# EAGLE design untitled (EAGLE 9.3.2)
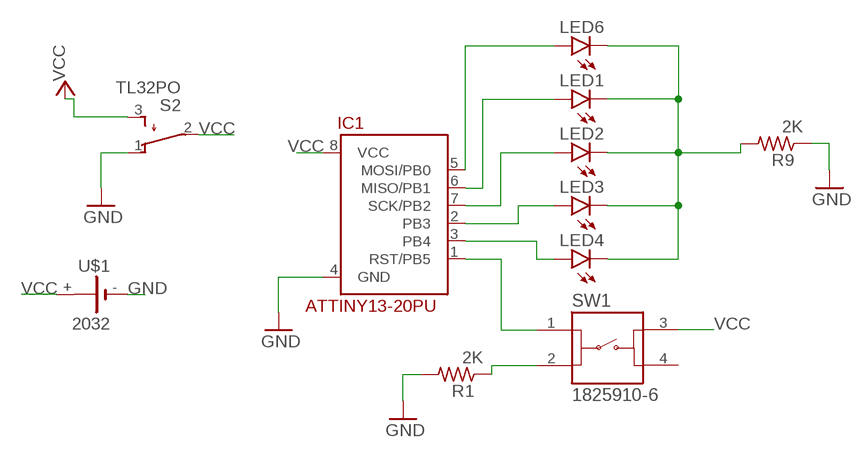
[diagram p0: schematic, sheet 1]

## Parts
IC1  ATTINY13-20PU  [DIL08]
LED1  LED3MM  [LED3MM]
LED2  LED3MM  [LED3MM]
LED3  LED3MM  [LED3MM]
LED4  LED3MM  [LED3MM]
LED6  LED3MM  [LED3MM]
R1  2K  R-US_0204/7  [0204/7]
R9  2K  R-US_0204/7  [0204/7]
S2  TL32PO  [TL3XPO]
SW1  1825910-6  [1825910-6]
U$1  2032  [KZH20SMD]

## Nets
GND: IC1.4(GND) R1.2 R9.1 S2.1(O) U$1.-
N$1: IC1.5(MOSI/PB0) LED6.A
N$2: IC1.6(MISO/PB1) LED1.A
N$3: IC1.7(SCK/PB2) LED2.A
N$4: IC1.2(PB3) LED3.A
N$5: IC1.3(PB4) LED4.A
N$6: LED1.K(C) LED2.K(C) LED3.K(C) LED4.K(C) LED6.K(C) R9.2
N$7: IC1.1(RST/PB5) SW1.1
N$8: R1.1 SW1.2
VCC: IC1.8(VCC) S2.2(P) S2.3(S) SW1.3 U$1.+
Unconnected: SW1.4

## Library data of the parts
IC1 = attiny13:ATTINY13-20*
LED1-LED4 LED6 = led:LED: LED OSRAM: - CHIPLED LG R971, LG N971, LY N971, LG Q971, LY Q971, LO R971, LY R971 LH N974, LH R974 LS Q976, LO Q976, LY Q976 LO Q996 - Hyper CHIPLED LW Q18S LB Q993, LB Q99A, LB R99A - SideLED LS A670, LO A670, LY A670, LG A670, LP A670 LB A673, LV A673, LT A673, LW A673 LH A674 LY A675 LS A676, LA A676, LO A676, LY A676, LW A676 LS A679, LY A679, LG A679 - Hyper Micro SIDELED® LS Y876, LA Y876, LO Y876, LY Y876 LT Y87S - SmartLED LW L88C, LW L88S LB L89C, LB L89S, LG L890 LS L89K, LO L89K, LY L89K LS L896, LA L896, LO L896, LY L896 - TOPLED LS T670, LO T670, LY T670, LG T670, LP T670 LSG T670, LSP T670, LSY T670, LOP T670, LYG T670 LG T671, LOG T671, LSG T671 LB T673, LV T673, LT T673, LW T673 LH T674 LS T676, LA T676, LO T676, LY T676, LB T676, LH T676, LSB T676, LW T676 LB T67C, LV T67C, LT T67C, LS T67K, LO T67K, LY T67K, LW E67C LS E67B, LA E67B, LO E67B, LY E67B, LB E67C, LV E67C, LT E67C LW T67C LS T679, LY T679, LG T679 LS T770, LO T770, LY T770, LG T770, LP T770 LB T773, LV T773, LT T773, LW T773 LH T774 LS E675, LA E675, LY E675, LS T675 LS T776, LA T776, LO T776, LY T776, LB T776 LHGB T686 LT T68C, LB T68C - Hyper Mini TOPLED® LB M676 - Mini TOPLED Santana® LG M470 LS M47K, LO M47K, LY M47K Source: http://www.osram.convergy.de LUXEON: - LUMILED® LXK2-PW12-R00, LXK2-PW12-S00, LXK2-PW14-U00, LXK2-PW14-V00 LXK2-PM12-R00, LXK2-PM12-S00, LXK2-PM14-U00 LXK2-PE12-Q00, LXK2-PE12-R00, LXK2-PE12-S00, LXK2-PE14-T00, LXK2-PE14-U00 LXK2-PB12-K00, LXK2-PB12-L00, LXK2-PB12-M00, LXK2-PB14-N00, LXK2-PB14-P00, LXK2-PB14-Q00 LXK2-PR12-L00, LXK2-PR12-M00, LXK2-PR14-Q00, LXK2-PR14-R00 LXK2-PD12-Q00, LXK2-PD12-R00, LXK2-PD12-S00 LXK2-PH12-R00, LXK2-PH12-S00 LXK2-PL12-P00, LXK2-PL12-Q00, LXK2-PL12-R00 Source: www.luxeon.com KINGBRIGHT: KA-3528ASYC Source: www.kingbright.com
R1 R9 = rcl:R-US_: RESISTOR, American symbol; SPICEPREFIX: R
S2 = switch:TL32PO: TINY SWITCH ON - MOM Source: http://www2.produktinfo.conrad.com/datenblaetter/700000-724999/705152-da-01-de-Subminiaturschalter_TL_36YO.pdf
SW1 = Switch:1825910-6: SWITCH TACTILE SPST-NO 0.05A 24V Manufacturer's datasheet <https://www.te.com/commerce/DocumentDelivery/DDEController?Action=srchrtrv&DocNm=1825910&DocType=Customer+Drawing&DocLang=English>; CREATED_BY: PCBLayout.com; DIGIKEY_PART_NUMBER: 450-1650-ND; MANUFACTURER: TE Connectivity ALCOSWITCH Switches; MPN: 1825910-6
U$1 = kzh20_lithium_batterie_holder:2032

## Board
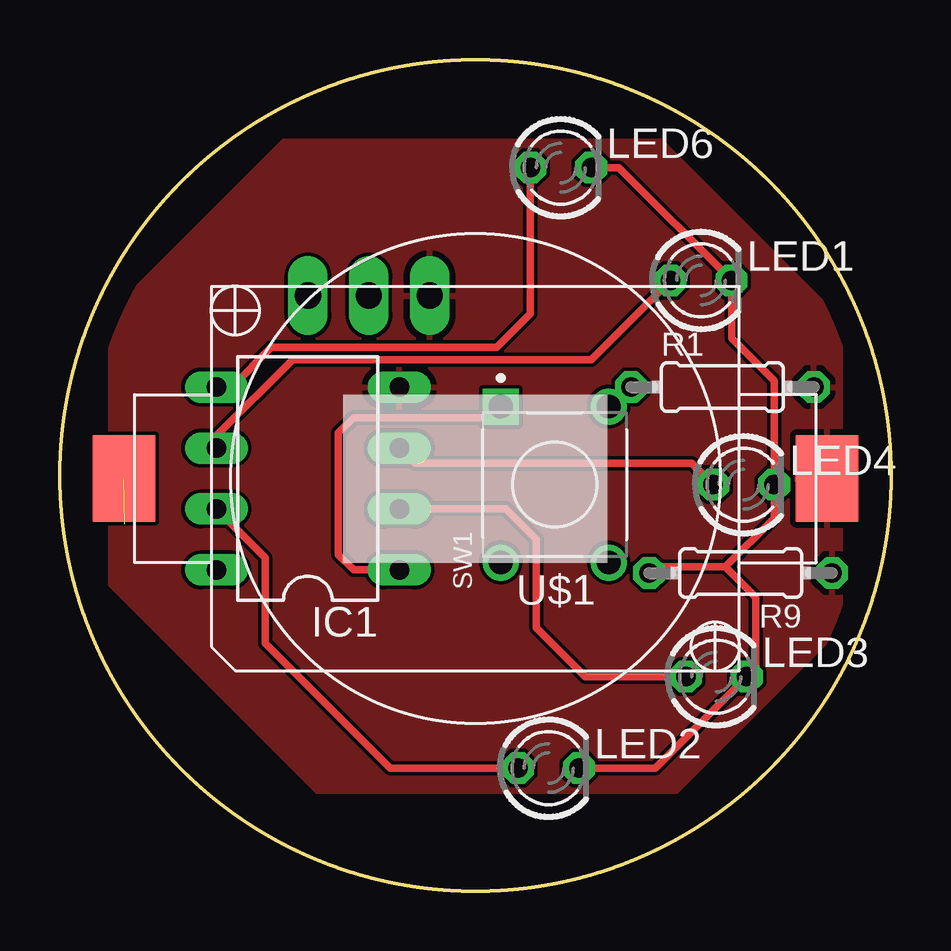
[diagram p1: board, top side]
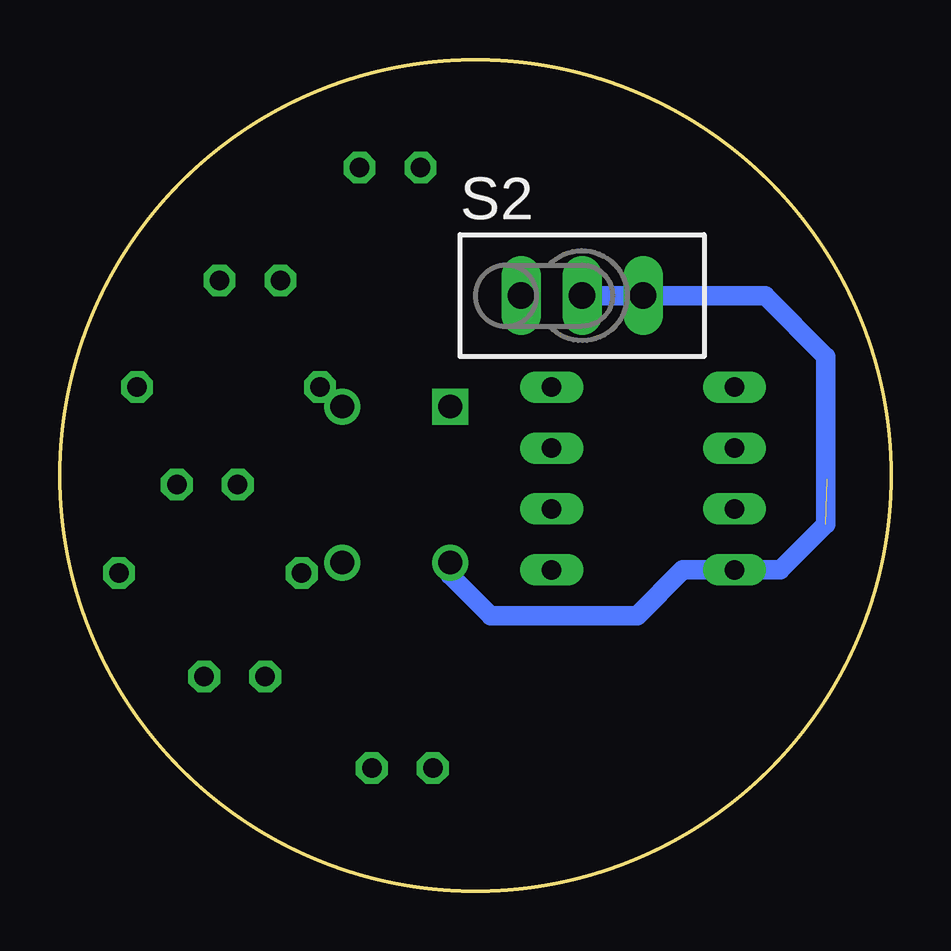
[diagram p2: board, bottom side, seen from below]

Size 34.62 x 34.62 mm. Coordinates in mm from the lower left corner, seen from the top.
Outline: circle at 17.31,17.31 radius 17.31
Copper layers (1*16): Top 0.035mm / dielectric 1.5mm / Bottom 0.035mm
Design rules "default": minimum track width 6mil, minimum drill 0.35mm, track to track 6mil, track to pad 6mil, pad to pad 6mil, via to via 6mil, smd to smd 6mil, copper to edge 40mil, drill to drill 6mil, minimum pad ring 10mil, minimum via ring 8mil, stop-mask expansion 4mil, vias tented up to drill 0mil, thermal gap 10mil

### Footprints (pad centres in the part's own frame; a part is rotated, then mirrored left to right if it is on the bottom)
DIL08 = drill 0.813 long: 1 -3.81,-3.81; 2 -1.27,-3.81; 3 1.27,-3.81; 4 3.81,-3.81; 5 3.81,3.81; 6 1.27,3.81; 7 -1.27,3.81; 8 -3.81,3.81
LED3MM = drill 0.813 octagon: A -1.27,0; K 1.27,0
0204/7 = drill 0.813 octagon: 1 -3.81,0; 2 3.81,0
TL3XPO = drill 1.1 pad 1.422 long: 1 -2.54,0; 2 0,0; 3 2.54,0
1825910-6 = drill 0.99 square: 1 3.25,2.25 | drill 0.99: 2 3.25,-2.25; 3 -3.25,2.25; 4 -3.25,-2.25
KZH20SMD = smd 2.6 x 3.6: + 14.65,0; - -14.65,0

### Placement (x,y rotation side)
IC1  10.33,17.18 90 top
LED1  26.71,25.44 0 top
LED2  20.36,5.12 0 top
LED3  27.34,8.93 0 top
LED4  28.49,16.93 0 top
LED6  20.87,30.14 0 top
R1  27.6,20.99 0 top
R9  28.36,13.25 180 top
S2  12.87,24.8 0 bottom
SW1  20.61,16.93 90 top
U$1  17.31,17.18 180 top

### Tracks (layer width: path | path; a pad name or v marks a point on that pad's centre or on a via)
GND
  pour Top: 2.07,24.04 9.31,31.28 25.06,31.28 32.55,23.79 32.55,10.96 25.69,4.1 10.71,4.1 2.07,12.74
N$1
  Top 0.305: LED6.A 19.6,24.04 18.2,22.65 8.8,22.65 7.15,20.99 IC1.5
N$2
  Top 0.305: IC1.6 6.52,18.96 9.69,22.14 22.14,22.14 LED1.A
N$3
  Top 0.305: IC1.7 8.55,13.88 8.55,10.33 13.76,5.12 LED2.A
N$4
  Top 0.305: IC1.2 18.58,15.91 19.85,14.64 19.85,10.96 21.88,8.93 LED3.A
N$5
  Top 0.305: IC1.3 14.77,17.82 26.33,17.82 LED4.A
N$6
  Top 0.305: LED2.K 24.8,5.12 LED3.K | LED3.K 28.49,9.06 | LED6.K 23.28,30.14 LED1.K 27.98,23.03 29.76,21.25 LED4.K 29.76,15.53 27.73,13.5 | R9.2 24.8,13.5 27.73,13.5 | LED3.K 29,9.31 29,12.23 27.73,13.5
N$7
  Top 0.305: SW1.1 17.91,19.72 12.23,19.72 11.6,19.09 11.6,14.01 12.23,13.37 IC1.1
N$8
  Top 0.305: R1.1 22.97,20.18 SW1.2
VCC  (1 unrouted)
  Bottom 0.813: S2.2 S2.3 5.25,24.8 2.71,22.26 2.71,15.28 4.61,13.37 IC1.8 8.68,13.37 10.58,11.47 16.68,11.47 18.36,13.16 SW1.3